# Altium schematic sheet AD7768_inputs_hall_crossboard_1_1.SchDoc
size A4
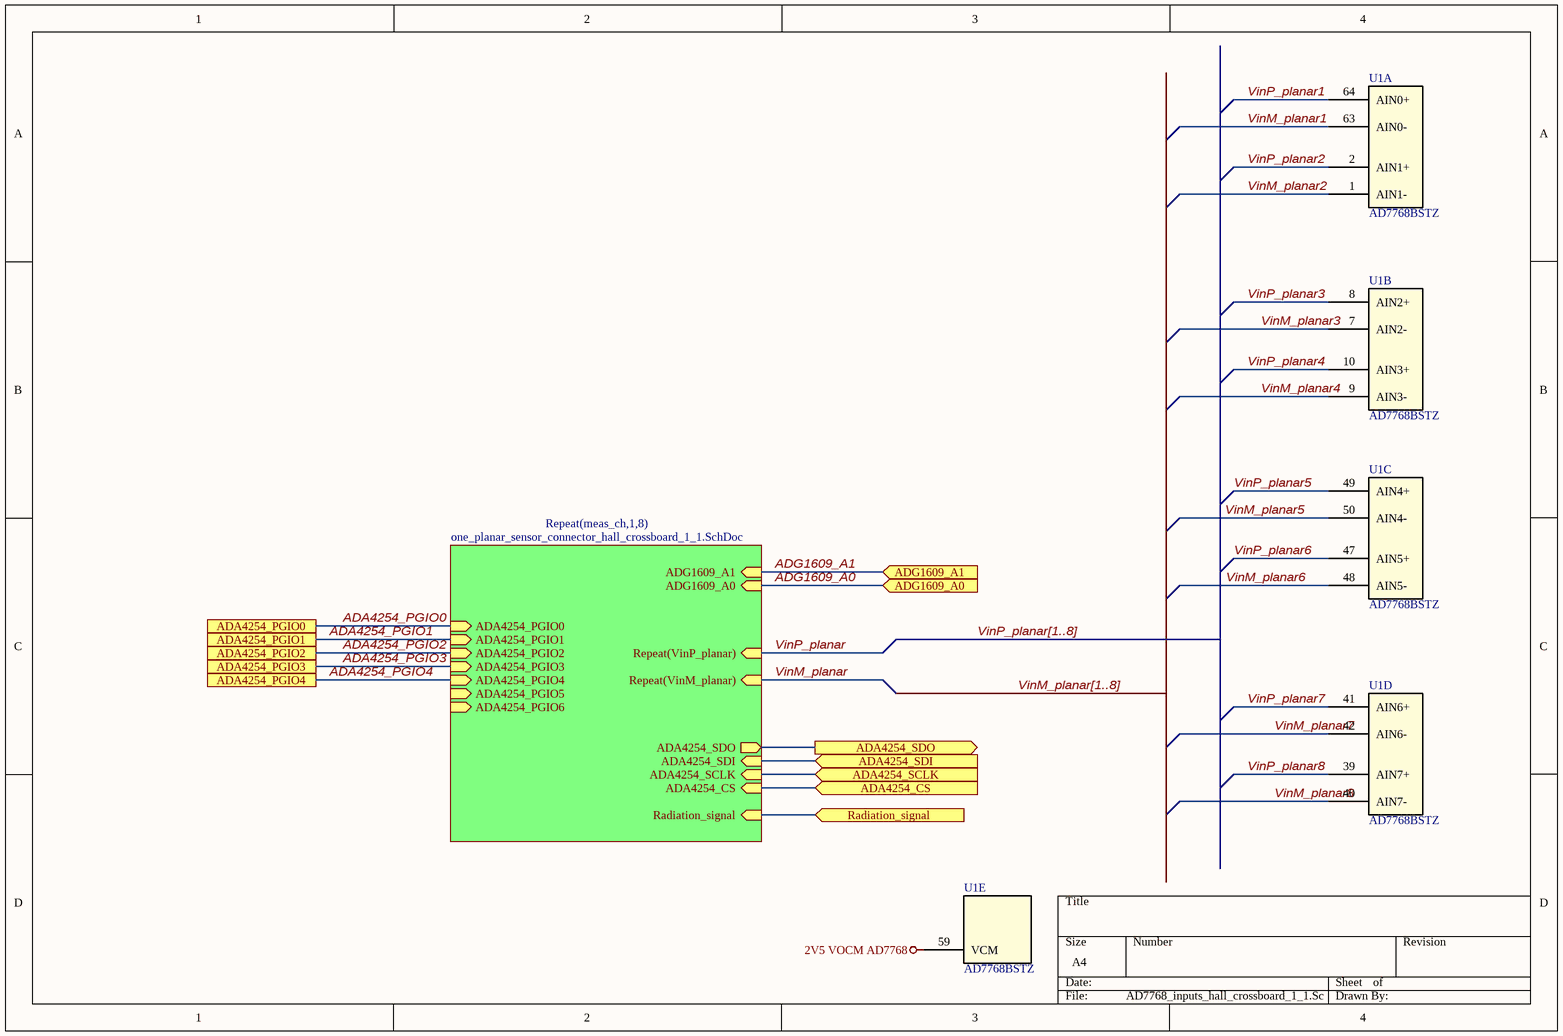
[diagram p0: AD7768_inputs_hall_crossboard_1_1.SchDoc]

## Parts
U1  AD7768BSTZ  [ST-64-2_ADI-M]  (parts A,B,C,D,E of 7)

## Sub-sheets
Repeat(meas_ch,1,8) = one_planar_sensor_connector_hall_crossboard_1_1.SchDoc: Repeat(VinP_planar) (in), Repeat(VinM_planar) (in), ADG1609_A0 (in), ADG1609_A1 (in), ADA4254_SDO (out), ADA4254_SDI (in), ADA4254_SCLK (in), ADA4254_CS (in), ADA4254_PGIO0 (in), ADA4254_PGIO1 (in), ADA4254_PGIO2 (in), ADA4254_PGIO3 (in), ADA4254_PGIO4 (in), ADA4254_PGIO5 (in), ADA4254_PGIO6 (in), Radiation_signal (in)

## Ports
ADA4254_CS (in), ADA4254_PGIO0, ADA4254_PGIO1, ADA4254_PGIO2, ADA4254_PGIO3, ADA4254_PGIO4, ADA4254_SCLK (in), ADA4254_SDI (in), ADA4254_SDO (out), ADG1609_A0 (in), ADG1609_A1 (in), Radiation_signal (in)

## Nets
2V5 VOCM AD7768: U1.59(VCM)
ADA4254_CS: port ADA4254_CS, sheet Repeat(meas_ch,1,8)/ADA4254_CS
ADA4254_PGIO0: port ADA4254_PGIO0, sheet Repeat(meas_ch,1,8)/ADA4254_PGIO0
ADA4254_PGIO1: port ADA4254_PGIO1, sheet Repeat(meas_ch,1,8)/ADA4254_PGIO1
ADA4254_PGIO2: port ADA4254_PGIO2, sheet Repeat(meas_ch,1,8)/ADA4254_PGIO2
ADA4254_PGIO3: port ADA4254_PGIO3, sheet Repeat(meas_ch,1,8)/ADA4254_PGIO3
ADA4254_PGIO4: port ADA4254_PGIO4, sheet Repeat(meas_ch,1,8)/ADA4254_PGIO4
ADA4254_SCLK: port ADA4254_SCLK, sheet Repeat(meas_ch,1,8)/ADA4254_SCLK
ADA4254_SDI: port ADA4254_SDI, sheet Repeat(meas_ch,1,8)/ADA4254_SDI
ADA4254_SDO: port ADA4254_SDO, sheet Repeat(meas_ch,1,8)/ADA4254_SDO
ADG1609_A0: port ADG1609_A0, sheet Repeat(meas_ch,1,8)/ADG1609_A0
ADG1609_A1: port ADG1609_A1, sheet Repeat(meas_ch,1,8)/ADG1609_A1
Radiation_signal: port Radiation_signal, sheet Repeat(meas_ch,1,8)/Radiation_signal
VinM_planar: sheet Repeat(meas_ch,1,8)/Repeat(VinM_planar)
VinM_planar1: U1.63(AIN0-)
VinM_planar2: U1.1(AIN1-)
VinM_planar3: U1.7(AIN2-)
VinM_planar4: U1.9(AIN3-)
VinM_planar5: U1.50(AIN4-)
VinM_planar6: U1.48(AIN5-)
VinM_planar7: U1.42(AIN6-)
VinM_planar8: U1.40(AIN7-)
VinP_planar: sheet Repeat(meas_ch,1,8)/Repeat(VinP_planar)
VinP_planar1: U1.64(AIN0+)
VinP_planar2: U1.2(AIN1+)
VinP_planar3: U1.8(AIN2+)
VinP_planar4: U1.10(AIN3+)
VinP_planar5: U1.49(AIN4+)
VinP_planar6: U1.47(AIN5+)
VinP_planar7: U1.41(AIN6+)
VinP_planar8: U1.39(AIN7+)

## Buses and harness runs
bus VinM_planar[1..8]
bus VinP_planar[1..8]

## Library data of the parts
U1 = AD7768BSTZ: No Description Available; Mfr_Name: Analog Devices Inc; Type: Data Acquisition; RefDes: RefDes